# Altium schematic sheet 1.SchDoc
size A
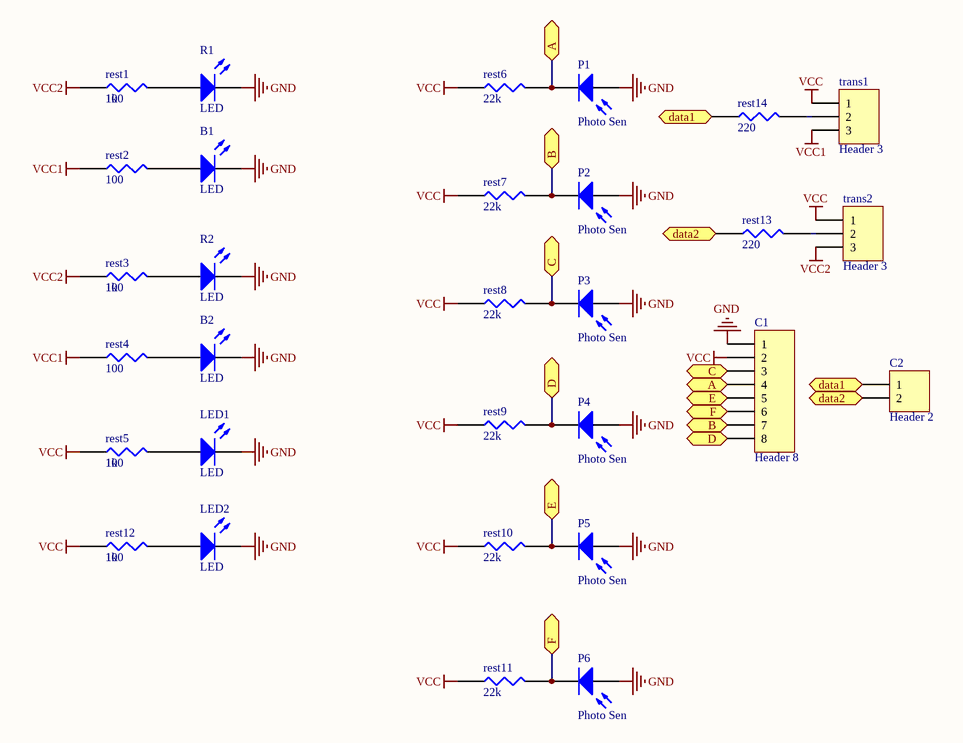
[diagram p0: 1.SchDoc]

## Parts
B1  LED  [My_LED3MM]
B2  LED  [My_LED3MM]
C1  Header 8  [HDR1X8]
C2  Header 2  [HDR1X2]
LED1  LED  [My_LED3MM]
LED2  LED  [My_LED3MM]
P1  Photo Sen  [PIN2]
P2  Photo Sen  [PIN2]
P3  Photo Sen  [PIN2]
P4  Photo Sen  [PIN2]
P5  Photo Sen  [PIN2]
P6  Photo Sen  [PIN2]
R1  LED  [My_LED3MM]
R2  LED  [My_LED3MM]
rest1  1k  value 100  [AXIAL-0.3]
rest2  100  [AXIAL-0.3]
rest3  1k  value 100  [AXIAL-0.3]
rest4  100  [AXIAL-0.3]
rest5  1k  value 100  [AXIAL-0.3]
rest6  value 22k  [AXIAL-0.3]  (hidden comment: 1k)
rest7  value 22k  [AXIAL-0.3]  (hidden comment: 1k)
rest8  value 22k  [AXIAL-0.3]  (hidden comment: 1k)
rest9  value 22k  [AXIAL-0.3]  (hidden comment: 1k)
rest10  value 22k  [AXIAL-0.3]  (hidden comment: 1k)
rest11  value 22k  [AXIAL-0.3]  (hidden comment: 1k)
rest12  1k  value 100  [AXIAL-0.3]
rest13  value 220  [AXIAL-0.3]  (hidden comment: 1k)
rest14  value 220  [AXIAL-0.3]  (hidden comment: 1k)
trans1  Header 3  [HDR1X3]
trans2  Header 3  [HDR1X3]

## Ports
A, B, C, D, data1, data2, E, F

## Nets
GND: B1.K B2.K C1.1 LED1.K LED2.K P1.1(A) P2.1(A) P3.1(A) P4.1(A) P5.1(A) P6.1(A) R1.K R2.K
VCC: C1.2 rest5.1 rest6.1 rest7.1 rest8.1 rest9.1 rest10.1 rest11.1 rest12.1 trans1.1 trans2.1
VCC1: rest2.1 rest4.1 trans1.3
VCC2: rest1.1 rest3.1 trans2.3
A: C1.4 P1.2(K) rest6.2 ; port A
B: C1.7 P2.2(K) rest7.2 ; port B
C: C1.3 P3.2(K) rest8.2 ; port C
D: C1.8 P4.2(K) rest9.2 ; port D
data1: C2.1 rest14.1 ; port data1
data2: C2.2 rest13.1 ; port data2
E: C1.5 P5.2(K) rest10.2 ; port E
F: C1.6 P6.2(K) rest11.2 ; port F
NetB1_A: B1.A rest2.2
NetB2_A: B2.A rest4.2
NetLED1_A: LED1.A rest5.2
NetLED2_A: LED2.A rest12.2
NetR1_A: R1.A rest1.2
NetR2_A: R2.A rest3.2
Netrest13_2: rest13.2 trans2.2
Netrest14_2: rest14.2 trans1.2

## Library data of the parts
B1 B2 LED1 LED2 R1 R2 = LED: Typical INFRARED GaAs LED; Published: 8-Jun-2000; LatestRevisionDate: 08-Jul-2005; LatestRevisionNote: Mech Layer 1 removed.; Publisher: Altium Limited
C1 = Header 8: Header, 8-Pin; LatestRevisionDate: 17-Jul-2002; LatestRevisionNote: Re-released for DXP Platform.; Publisher: Altium Limited
C2 = Header 2: Header, 2-Pin; LatestRevisionDate: 17-Jul-2002; LatestRevisionNote: Re-released for DXP Platform.; Publisher: Altium Limited
P1-P6 = Photo Sen: Photosensitive Diode; Published: 24-Mar-1999; LatestRevisionDate: 17-Jul-2002; LatestRevisionNote: Re-released for DXP Platform.; PackageReference: PIN2; Publisher: Altium Limited
rest1 rest3 rest5-rest14 = Res: resistor 1/4 wat
rest2 rest4 = Res: resistor 1/4 wat; Value: 1k
trans1 trans2 = Header 3: Header, 3-Pin; LatestRevisionDate: 17-Jul-2002; LatestRevisionNote: Re-released for DXP Platform.; Publisher: Altium Limited